# EAGLE design SolderingStation (EAGLE 7.1.0)
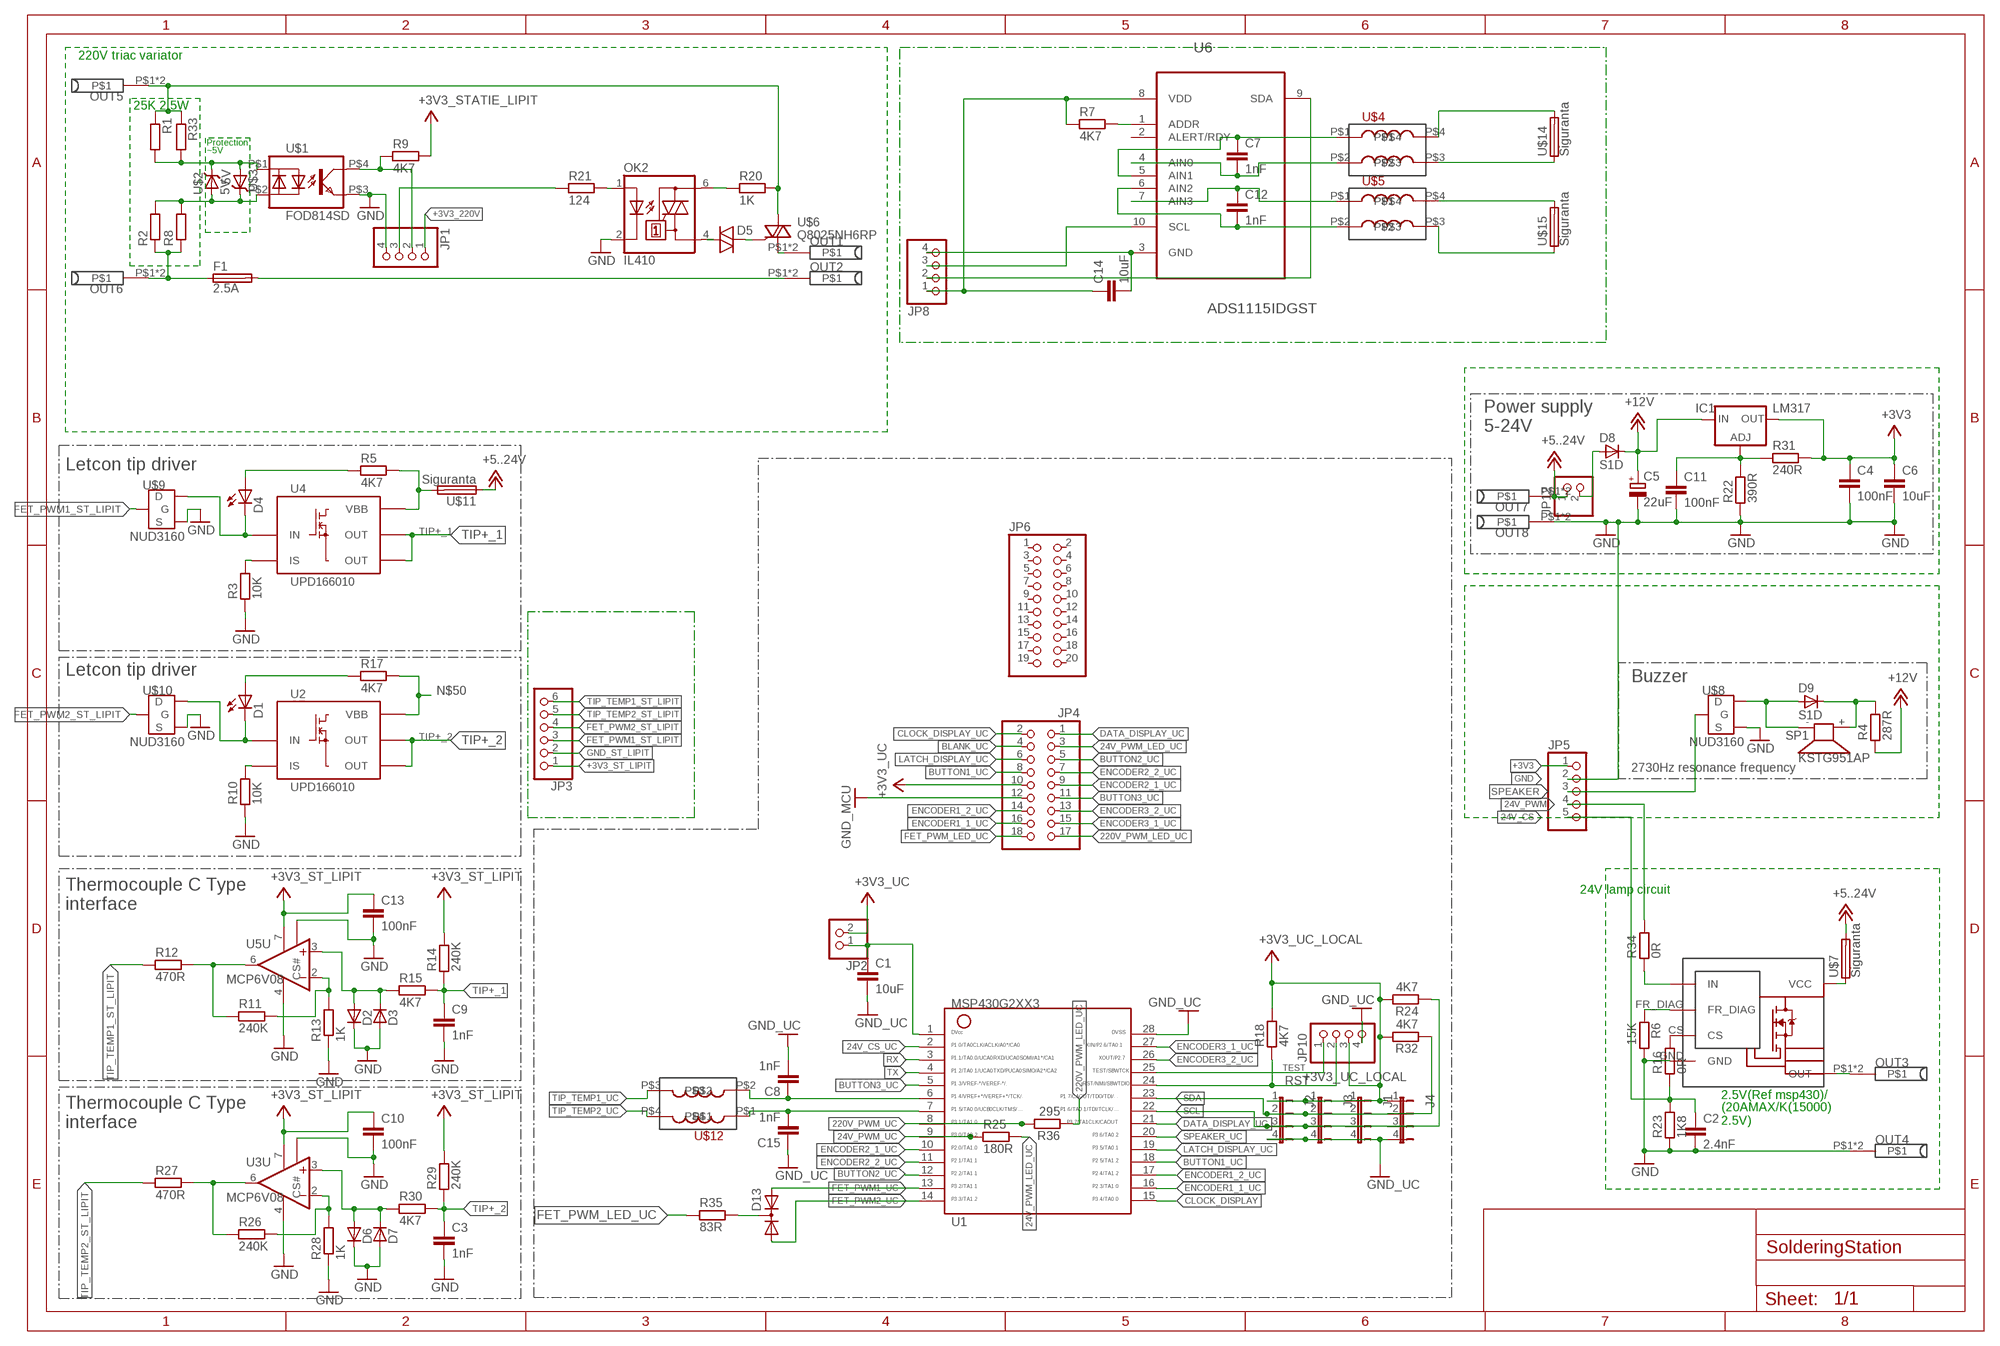
[diagram p0: schematic, sheet 1]

## Parts
C1  10uF  C1206  [1206]
C2  2.4nF  C0805  [0805]
C3  1nF  C0805  [0805]
C4  100nF  C1206  [1206]
C5  22uF  C_ELECTROLYTIC2  [C_EL_6.3X5.4]
C6  10uF  C1206  [1206]
C7  1nF  C0805  [0805]
C8  1nF  C0805  [0805]
C9  1nF  C0805  [0805]
C10  100nF  C0805  [0805]
C11  100nF  C1206  [1206]
C12  1nF  C0805  [0805]
C13  100nF  C0805  [0805]
C14  10uF  C0805  [0805]
C15  1nF  C0805  [0805]
CLH1  VN7004  [OCTAPAK]
D1  LED3MM  [LED_3MM]
D2  DIODES1D  [S1D]
D3  DIODES1D  [S1D]
D4  LED3MM  [LED_3MM]
D5  DIAC-DO35-10  [DO35-10]
D6  DIODES1D  [S1D]
D7  DIODES1D  [S1D]
D8  S1D  DIODES1D  [S1D]
D9  S1D  DIODES1D  [S1D]
D13  DIODE-2AC|CASOT23  [SOT23]
F1  2.5A  GSH15  [GSH15]
IC1  LM317  LM317MABDT  [DPACK]
J1  JP4  [JP4]
J2  JP4  [JP4]
J3  JP4  [JP4]
J4  JP4  [JP4]
JP1  PINHD-1X4/90  [1X04/90]
JP2  PINHD-1X2  [1X02]
JP3  PINHD-1X6/90  [1X06/90]
JP4  PINHD-2X9  [2X09]
JP5  PINHD-1X5/90  [1X05/90]
JP6  PINHD-2X10/90  [2X10/90]
JP8  PINHD-1X4/90  [1X04/90]
JP10  PINHD-1X4  [1X04]
JP12  PINHD-1X2  [1X02]
OK2  IL410  [DIL06]
OUT1  BANANA  [BANANA]
OUT2  BANANA  [BANANA]
OUT3  BANANA  [BANANA]
OUT4  BANANA  [BANANA]
OUT5  BANANA  [BANANA]
OUT6  BANANA  [BANANA]
OUT7  BANANA  [BANANA]
OUT8  BANANA  [BANANA]
R1  RESISTOR-PTH-0.4  [RTH025W]
R2  RESISTOR-PTH-0.4  [RTH025W]
R3  10K  R0805  [0805]
R4  287R  R1206  [1206]
R5  4K7  R0805  [0805]
R6  15K  R0805  [0805]
R7  4K7  R0805  [0805]
R8  RESISTOR-PTH-0.4  [RTH025W]
R9  4K7  R1206  [1206]
R10  10K  R0805  [0805]
R11  240K  R0805  [0805]
R12  470R  R0805  [0805]
R13  1K  R0805  [0805]
R14  240K  R0805  [0805]
R15  4K7  R0805  [0805]
R16  0R  R0805  [0805]
R17  4K7  R0805  [0805]
R18  4K7  R0805  [0805]
R20  1K  R1206  [1206]
R21  124  R1206  [1206]
R22  390R  R0805  [0805]
R23  1K8  R0805  [0805]
R24  4K7  R0805  [0805]
R25  180R  R0805  [0805]
R26  240K  R0805  [0805]
R27  470R  R0805  [0805]
R28  1K  R0805  [0805]
R29  240K  R0805  [0805]
R30  4K7  R0805  [0805]
R31  240R  R0805  [0805]
R32  4K7  R0805  [0805]
R33  RESISTOR-PTH-0.4  [RTH025W]
R34  0R  R0805  [0805]
R35  83R  R0805  [0805]
R36  295  R1206  [1206]
SP1  KSTG951AP  [KSTG951AP]
U1  MSP340G2443  G2XX3---PW28  [PW28]
U2  UPD166010  [TO252-51]
U3  MCP6V08  MCP6V08SN  [SO08]
U4  UPD166010  [TO252-51]
U5  MCP6V08  MCP6V08SN  [SO08]
U6  ADS1115IDGST  [SOP50P490X110-10N]
U$1  FOD814SD  [DIP_4PIN]
U$2  5V  ZENER  [ZENER]
U$3  5V  ZENER  [ZENER]
U$4  COIL  [UNDEF1]
U$5  COIL  [UNDEF1]
U$6  Q8025NH6RP  [TO-263]
U$7  Siguranta  SOCLU_THERMOCOUPLE  [SOCLU_THERMOCOUPLE]
U$8  NUD3160  [SOT23]
U$9  NUD3160  [SOT23]
U$10  NUD3160  [SOT23]
U$11  Siguranta  SOCLU_THERMOCOUPLE  [SOCLU_THERMOCOUPLE]
U$12  COIL  [UNDEF1]
U$14  Siguranta  SOCLU_THERMOCOUPLE  [SOCLU_THERMOCOUPLE]
U$15  Siguranta  SOCLU_THERMOCOUPLE  [SOCLU_THERMOCOUPLE]

## Nets
24V_CS: C2.1 JP5.5 R16.1 R23.2
24V_CS_UC: U1.2
24V_PWM: JP5.4 R34.2
24V_PWM_LED_UC: JP4.3 R25.2
24V_PWM_UC: R25.1 U1.9
220V_PWM_LED_UC: JP4.17 R36.1
220V_PWM_UC: R36.2 U1.8
+3V3: C4.1 C6.1 IC1.4(OUT) JP5.1 R31.2
+3V3_220V: JP1.1 R9.2 ; supply symbol labelled +3V3_STATIE_LIPIT
+3V3_ST_LIPIT: C10.1 C13.1 JP3.1 R14.2 R29.2 U3.7(U:V+) U5.7(U:V+)
+3V3_UC: JP2.2 JP4.10
+3V3_UC_LOCAL: C1.1 J1.1 J2.1 J3.1 J4.1 JP2.1 JP10.3 R18.2 R24.2 R32.2 U1.1
+12V: C5.+ D8.C IC1.3(IN) R4.1
+15V: JP12.1 OUT7.P$1 OUT7.P$2 U$7.1B U$7.2B U$11.1A U$11.2A ; supply symbol labelled +5..24V
BLANK_UC: JP4.4
BUTTON1_UC: JP4.8 U1.18
BUTTON2_UC: JP4.5 U1.12
BUTTON3_UC: JP4.11 U1.5
CLOCK_DISPLAY: U1.15
CLOCK_DISPLAY_UC: JP4.2
DATA_DISPLAY_UC: JP4.1 U1.21
ENCODER1_1_UC: JP4.16 U1.16
ENCODER1_2_UC: JP4.14 U1.17
ENCODER2_1_UC: JP4.9 U1.10
ENCODER2_2_UC: JP4.7 U1.11
ENCODER3_1_UC: JP4.15 U1.27
ENCODER3_2_UC: JP4.13 U1.26
FET_PWM1_ST_LIPIT: JP3.3 U$9.1(G)
FET_PWM1_UC: D13.2(A2) U1.13
FET_PWM2_ST_LIPIT: JP3.4 U$10.1(G)
FET_PWM2_UC: D13.1(A1) U1.14
FET_PWM_LED_UC: JP4.18 R35.1
GND: C2.2 C4.2 C5.- C6.2 C8.2 C11.2 C15.1 CLH1.GND J2.4 J3.4 J4.4 JP5.2 OUT4.P$1 OUT4.P$2 OUT8.P$1 OUT8.P$2 R6.2 R22.1 R23.1 U$8.2(S) ; supply symbol labelled GND_UC
GND_220V: JP1.4 OK2.2(C) U$1.P$3(EMIT) ; supply symbol labelled GND
GND_ST_LIPIT: C3.2 C9.2 C10.2 C13.2 D2.C D3.A D6.C D7.A JP3.2 R3.1 R10.1 R13.1 R28.1 U3.4(U:V-) U3.8(CS#) U5.4(U:V-) U5.8(CS#) U$9.2(S) U$10.2(S) ; supply symbol labelled GND
GND_TERMOCOUPLE: C14.2 JP8.4 U6.3(GND)
GND_UC: C1.2 JP4.12 JP10.4 U1.28 ; supply symbol labelled GND_MCU
LATCH_DISPLAY_UC: JP4.6 U1.19
N$2: D1.K(C) U2.2(IN) U$10.3(D)
N$3: D4.A R5.1
N$4: D1.A R17.1
N$5: D9.A SP1.- U$8.3(D)
N$6: CLH1.CS R16.2
N$7: D4.K(C) U4.2(IN) U$9.3(D)
N$8: R10.2 U2.4(IS)
N$9: R26.1 R27.2 U3.6(U:OUT)
N$10: D6.A D7.C R30.1 U3.3(U:+IN)
N$11: R26.2 R28.2 U3.2(U:-IN)
N$12: OK2.6(A2) R20.1
N$13: D5.A OK2.4(A1)
N$14: OK2.1(A) R21.2
N$15: JP1.3 R21.1
N$16: CLH1.VCC U$7.1A U$7.2A
N$18: D5.C U$6.G
N$19: D9.C R4.2 SP1.+
N$20: CLH1.FR_DIAG R6.1
N$21: F1.1 OUT6.P$1 OUT6.P$2 R2.1 R8.1
N$27: R3.2 U4.4(IS)
N$28: D13.3(C) R35.2
N$29: R11.1 R12.2 U5.6(U:OUT)
N$30: R1.2 R33.2 U$1.P$1(ANODE) U$2.K U$3.A
N$31: D2.A D3.C R15.1 U5.3(U:+IN)
N$32: R2.2 R8.2 U$1.P$2(CATHODE) U$2.A U$3.K
N$34: R11.2 R13.2 U5.2(U:-IN)
N$35: CLH1.OUTPUT1(OUT) CLH1.OUTPUT2(OUT) CLH1.OUTPUT3(OUT) OUT3.P$1 OUT3.P$2
N$36: JP1.2 R9.1 U$1.P$4(COL)
N$37: C8.1 U1.6 U$12.P$2
N$38: R7.2 U6.1(ADDR)
N$39: C15.2 U1.7 U$12.P$1
N$40: C7.1 U6.5(AIN1) U$4.P$1
N$41: C7.2 U6.4(AIN0) U$4.P$2
N$42: C11.1 IC1.1(ADJ) R22.2 R31.1
N$43: C12.1 U6.7(AIN3) U$5.P$1
N$44: C12.2 U6.6(AIN2) U$5.P$2
N$46: CLH1.INPUT(IN) R34.1
N$50: R5.2 R17.2 U2.TAB(VBB) U4.TAB(VBB) U$11.1B U$11.2B
N$51: D8.A JP12.2
N$52: U$4.P$3 U$14.1A U$14.2A
N$53: U$4.P$4 U$14.1B U$14.2B
N$54: U$5.P$4 U$15.1B U$15.2B
N$55: U$5.P$3 U$15.1A U$15.2A
N$56: J1.4
RST: JP10.2 R18.1 U1.24
RX: U1.3
SCL: J1.3 J2.3 J3.3 J4.3 R24.1 U1.22
SCL_TERMOCOUPLE: JP8.3 U6.10(SCL)
SDA: J1.2 J2.2 J3.2 J4.2 R32.1 U1.23
SDA_TERMOCOUPLE: JP8.2 U6.9(SDA)
SPEAKER: JP5.3 U$8.1(G)
SPEAKER_UC: U1.20
TEST: JP10.1 U1.25
TIP+_1: C9.1 R14.1 R15.2 U4.1(OUT) U4.5(OUT)
TIP+_2: C3.1 R29.1 R30.2 U2.1(OUT) U2.5(OUT)
TIP_TEMP1_ST_LIPIT: JP3.6 R12.1
TIP_TEMP1_UC: U$12.P$3
TIP_TEMP2_ST_LIPIT: JP3.5 R27.1
TIP_TEMP2_UC: U$12.P$4
TX: U1.4
VCC_TERMOCOUPLE: C14.1 JP8.1 R7.1 U6.8(VDD)
~+OUT: F1.2 OUT2.P$1 OUT2.P$2
~-OUT: OUT1.P$1 OUT1.P$2 U$6.T1
~IN1: OUT5.P$1 OUT5.P$2 R1.1 R20.2 R33.1 U$6.T2
Unconnected: JP6.1 JP6.2 JP6.3 JP6.4 JP6.5 JP6.6 JP6.7 JP6.8 JP6.9 JP6.10 JP6.11 JP6.12 JP6.13 JP6.14 JP6.15 JP6.16 JP6.17 JP6.18 JP6.19 JP6.20 U6.2(ALERT/RDY)

## Notes on the sheet
- 220V triac variator
- 25K 2.5W
- Protection
- ~5V
- Power supply
- 5-24V
- Letcon tip driver
- Letcon tip driver
- Buzzer
- 2730Hz resonance frequency
- Thermocouple C Type | 24V lamp circuit
- interface
- 2.5V(Ref msp430)/
- Thermocouple C Type
- (20AMAX/K(15000)
  2.5V)
- interface

## Library data of the parts
C1 C3 C7-C10 C12 C13 C15 = adi_v1.2:C: SMD capacitor 0603 0805 1206
C2 C4 C6 C11 C14 = ATE:C: SMD capacitor 0603 0805 1206
C5 = adi_v1.4:C_ELECTROLYTIC: Electrolytic capacitor 8x10mm 6.3x5.4mm
CLH1 = Serghei IR station:VN7004
D1 D4 = adi_v1.4:LED: LED
D2 D3 D6-D8 = adi_v1.3:DIODE: Generic Diode
D5 = diode:DIAC-: DIAC
D9 = adi_v1.4:DIODE: Generic Diode
D13 = diode:DIODE-2AC|CA: Dual DIODE Anode-Cathode|Cathode-Anode
F1 = fuse:GSH15: FUSE HOLDER grid 15mm, 19649 Wickmann; MPN: 64900001039; OC_FARNELL: 1271673; OC_NEWARK: 02P0318
IC1 = v-reg:LM317?*: 500 mA Adjustable Output Positive Voltage Regulator Source: http://www.onsemi.co.jp .. LM317M-D.PDF
J1-J4 = adi_v1.4:JP4
JP1 JP8 JP10 = pinhead:PINHD-1X4: PIN HEADER
JP2 JP12 = pinhead:PINHD-1X2: PIN HEADER
JP3 = pinhead:PINHD-1X6: PIN HEADER
JP4 = pinhead:PINHD-2X9: PIN HEADER
JP5 = pinhead:PINHD-1X5: PIN HEADER
JP6 = pinhead:PINHD-2X10: PIN HEADER
OK2 = optocoupler:IL410: SIEMENS OPTO COUPLER; MF: VISHAY/TELEFUNKEN; MPN: IL410; OC_FARNELL: 1045434; OC_NEWARK: 58K1715
OUT1-OUT8 = H_bridge_library:BANANA
R1 R2 R8 R33 = dp_devices:RESISTOR
R3-R7 R10-R18 R22-R32 R34 R35 = adi_v1.2:R
R9 R20 R21 R36 = H_bridge_library:R
SP1 = adi_v1.4:KSTG951AP: SPEAKER Source: Schukat; OC_FARNELL: http://ro.farnell.com/kingstate/kstg951ap/buzzer-magnetic-pin-85db-5v/dp/2215078?Ntt=KSTG951AP; OC_NEWARK: unknown
U1 = adi_v1.3:G2XX3---PW28: MSP430G2XX1 TSSOP (PW) 28 Pin Package
U2 U4 = adi_v1.3:UPD166010
U3 U5 = adi_v1.3:MCP6V08: Single Op Amp 2.7V to 6.0V Single Supply CMOS Source: http://ww1.microchip.com/downloads/en/DeviceDoc/21314g.pdf
U6 = Texas Instruments_By_element14_Batch_1:ADS1115IDGST: Analog-to-Digital Converter with Internal Reference; MPN: ADS1115IDGST; OC_FARNELL: 1762981; OC_NEWARK: 25R1241; PACKAGE: MSOP-10; SUPPLIER: Texas Instruments
U$1 = Serghei IR station:FOD814SD
U$2 U$3 = adi_v1.6:ZENER: Zener diode - Farnell <http://ro.farnell.com/vishay-semiconductor/1n5231b/diode-zener-5-1v-0-5w/dp/1612371> 1N5231B DIODE, ZENER, 5.1V, 0.5W Diode Case Style:DO-35 Forward Current If(AV):200mA Termination Type:Axial Leaded
U$4 U$5 U$12 = Serghei IR station:COIL
U$6 = Serghei IR station:Q8025NH6RP
U$7 U$11 U$14 U$15 = Serghei IR station:SOCLU_THERMOCOUPLE
U$8-U$10 = adi_v1.4:NUD3160

## Board
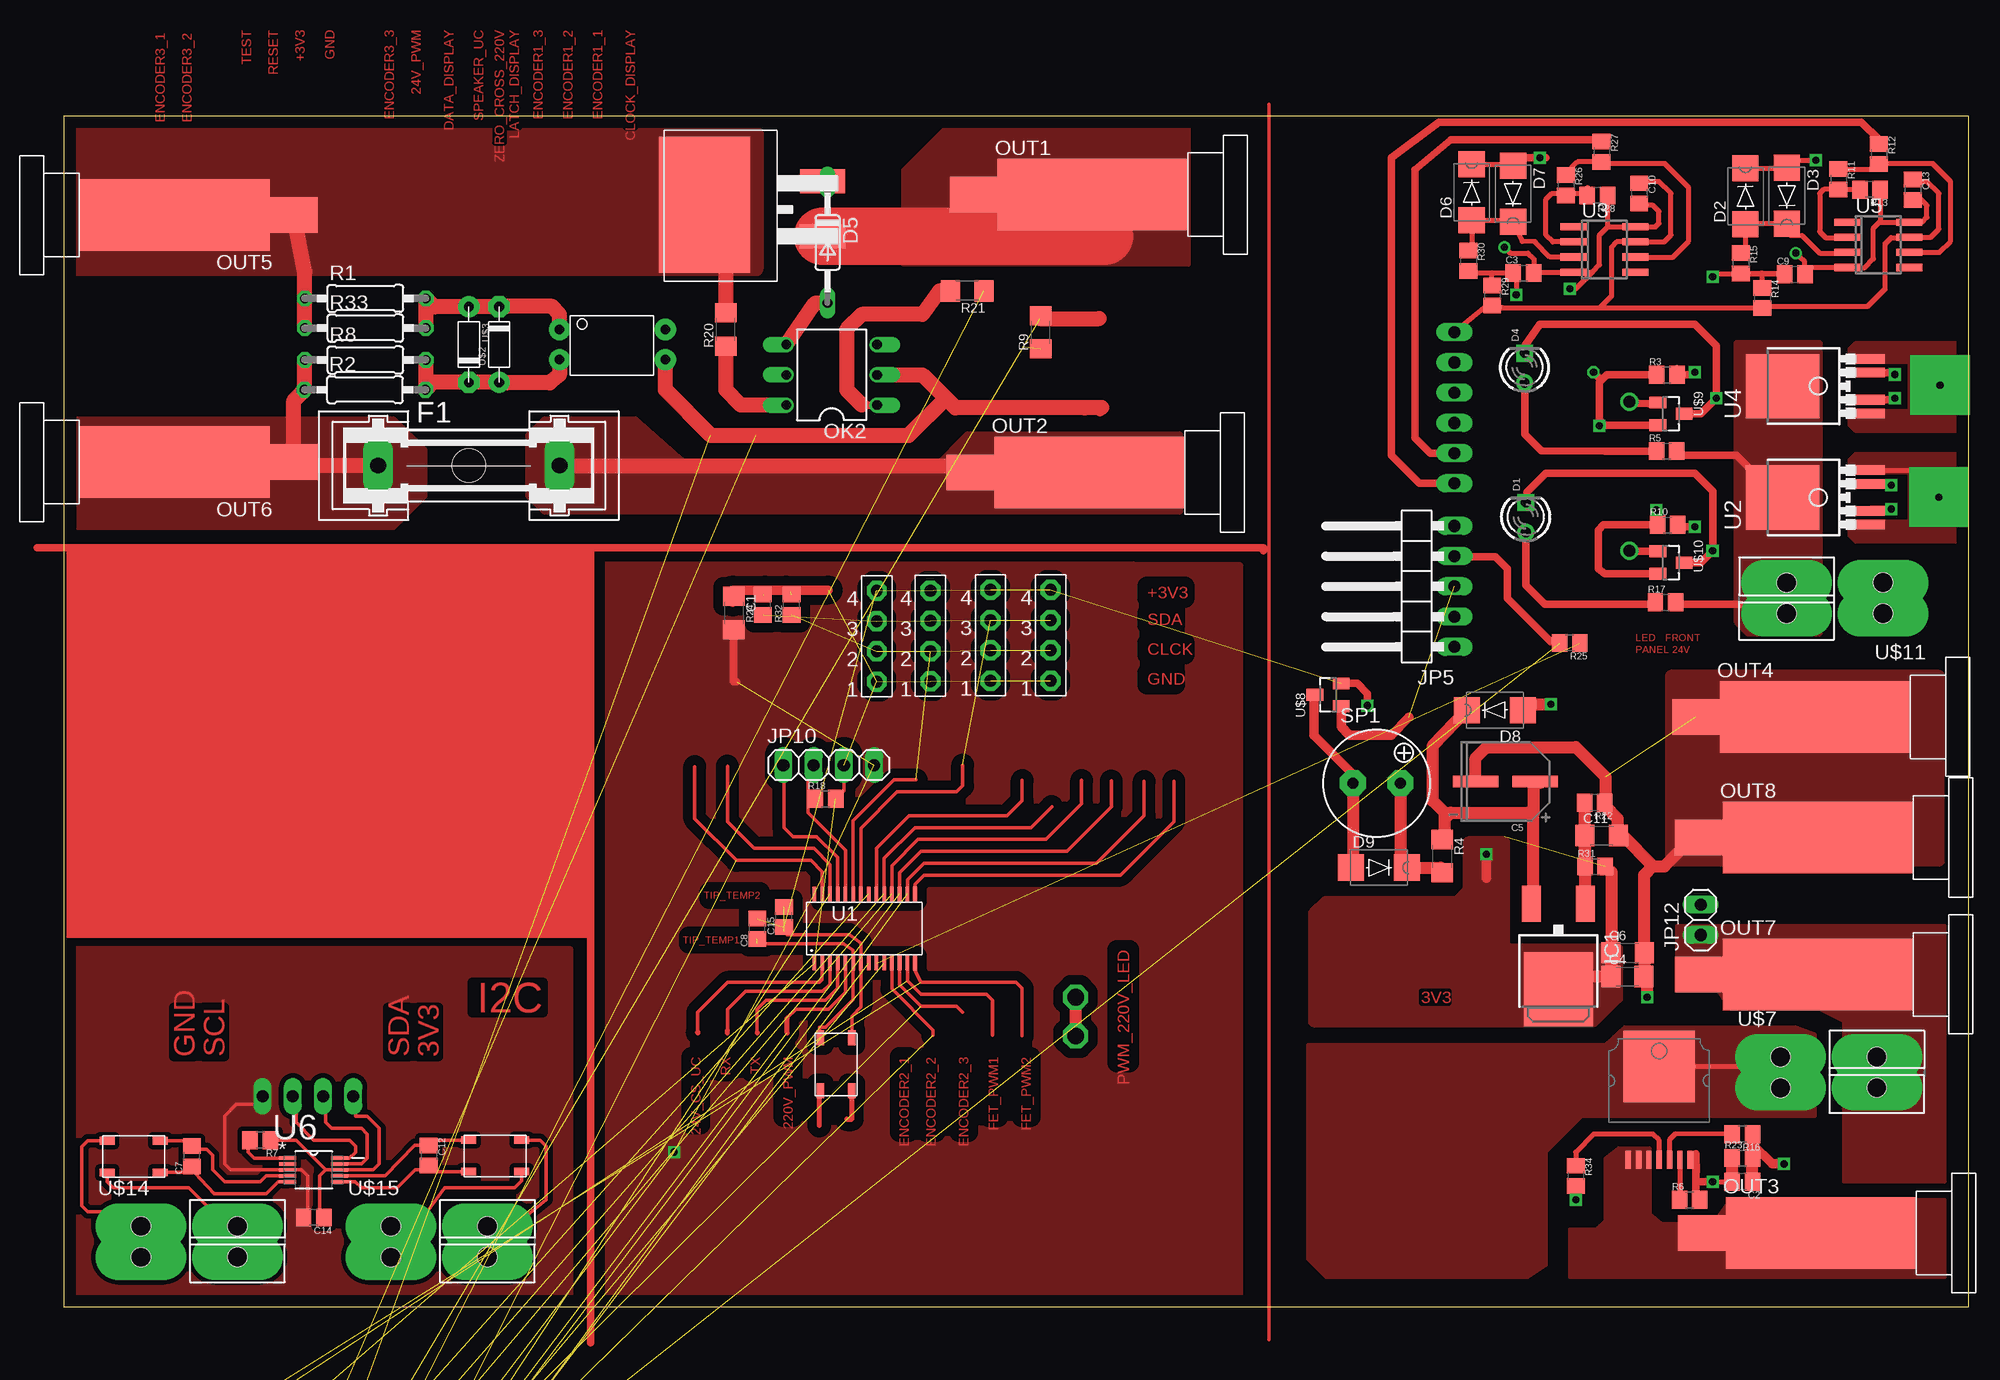
[diagram p1: board, top side]
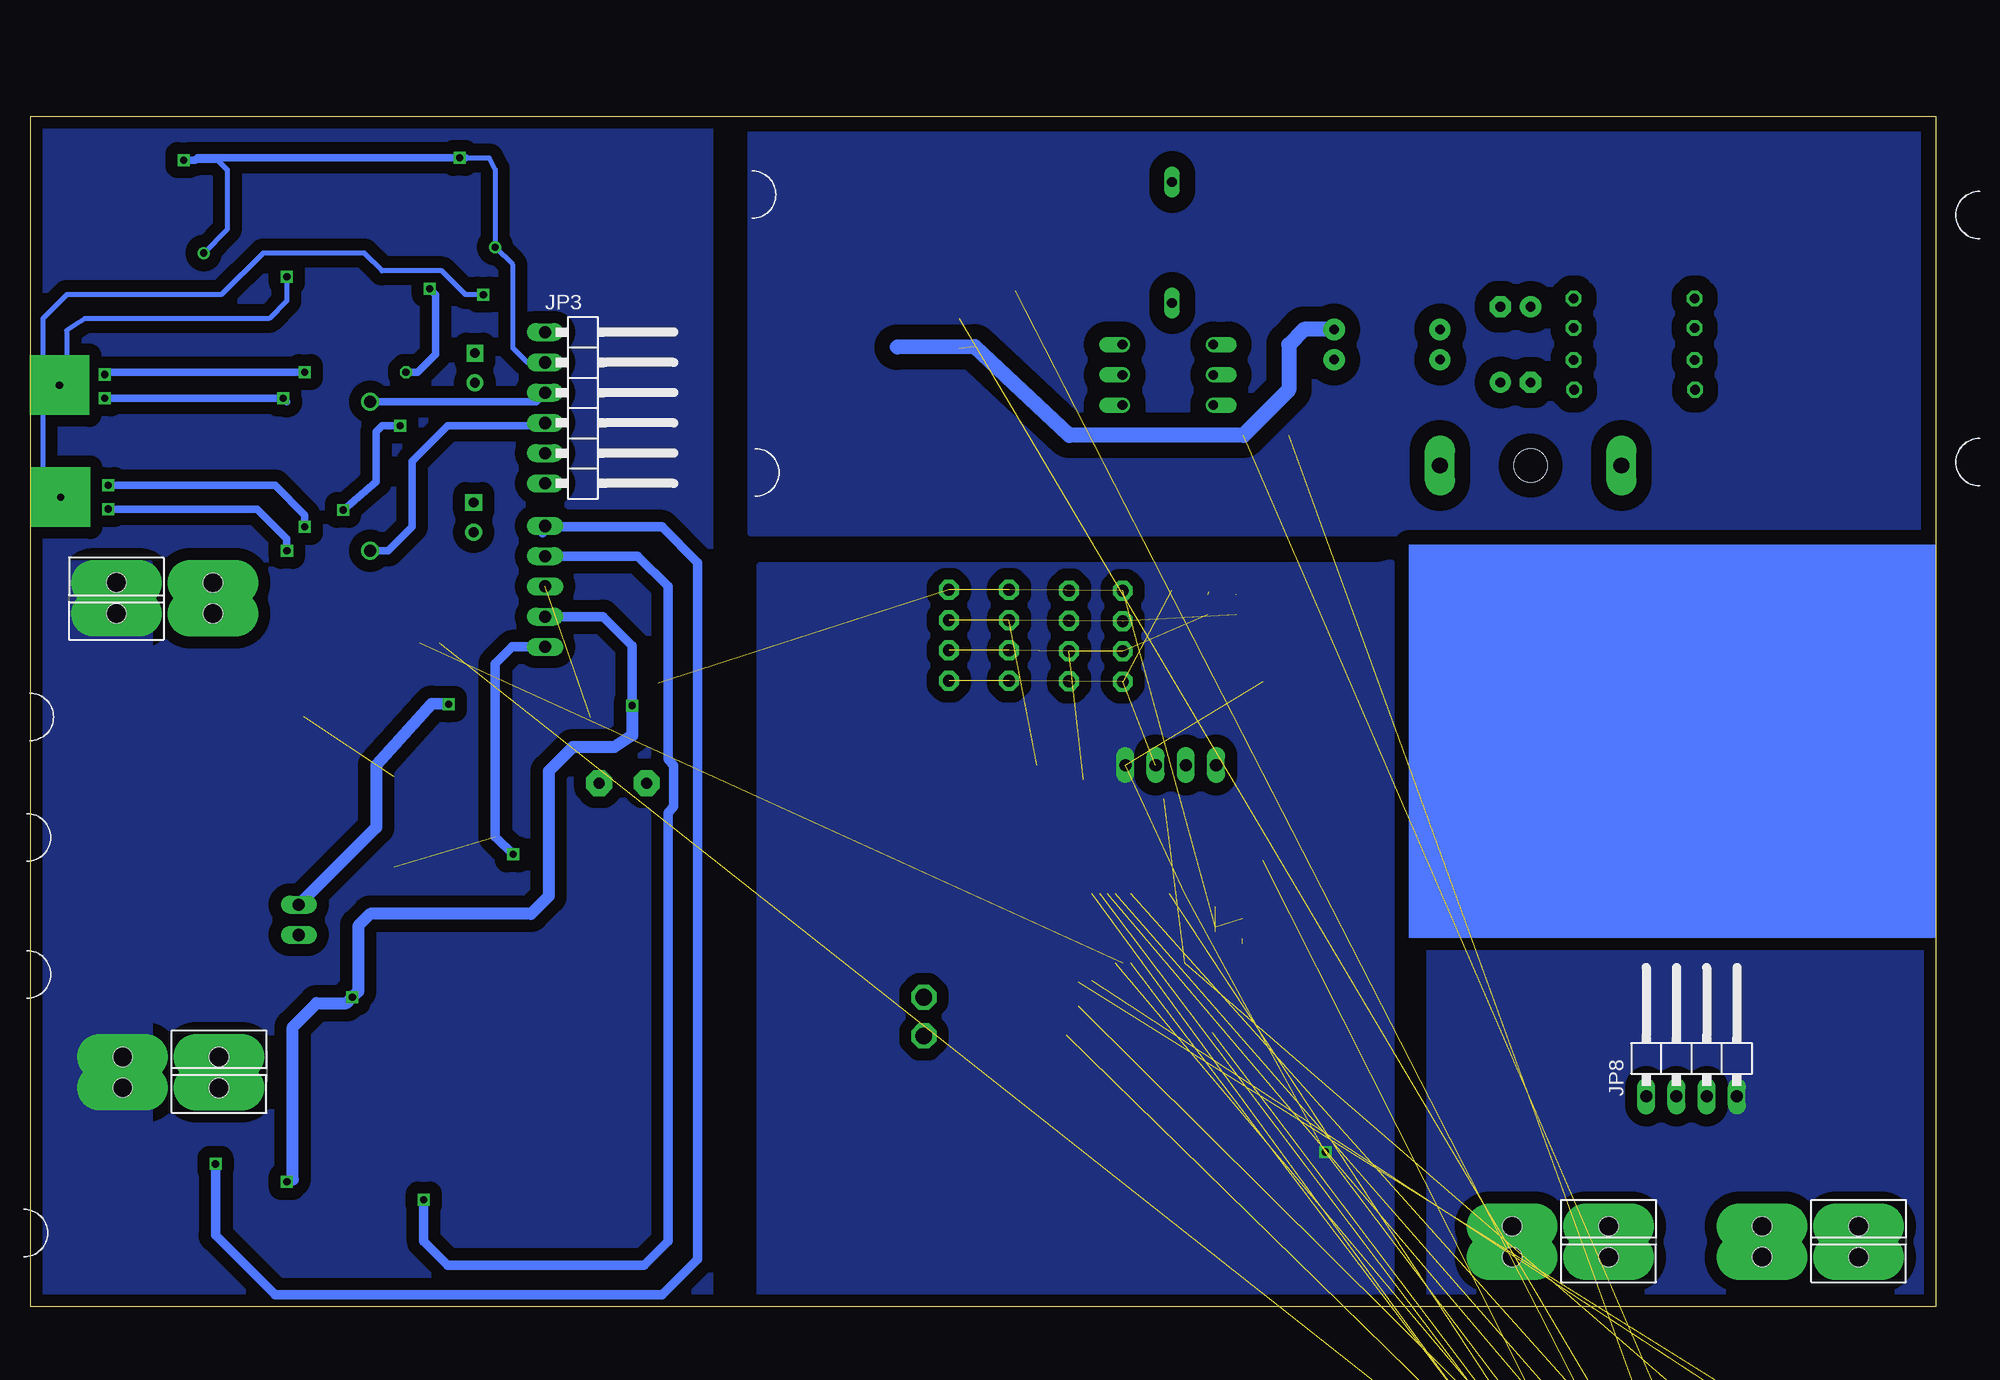
[diagram p2: board, bottom side, seen from below]

Size 160 x 100 mm. Coordinates in mm from the lower left corner, seen from the top.
Outline: 0,0 160,0 160,100 0,100 0,0
Copper layers (1*16): Top 0.035mm / dielectric 1.5mm / Bottom 0.035mm
Design rules "default": minimum track width 10mil, minimum drill 24mil, track to track 8mil, track to pad 8mil, pad to pad 8mil, via to via 8mil, smd to smd 8mil, copper to edge 40mil, drill to drill 8mil, minimum pad ring 10mil, minimum via ring 8mil, stop-mask expansion 4mil, vias tented up to drill 0mil, thermal gap 10mil

### Footprints (pad centres in the part's own frame; a part is rotated, then mirrored left to right if it is on the bottom)
1206 = smd 1.6 x 1.8: 1 -1.4,0; 2 1.4,0
0805 = smd 1.3 x 1.5: 1 -0.85,0; 2 0.85,0
C_EL_6.3X5.4 = smd 3.81 x 1: + -2.5,0; - 2.5,0
OCTAPAK = smd 0.45 x 1.5: CS 0.88,-7.14; FR_DIAG 1.75,-7.14; GND 2.62,-7.14; INPUT 0.01,-7.14; OUTPUT1 -1.73,-7.14; OUTPUT2 -2.6,-7.14; OUTPUT3 -0.86,-7.14 | smd 6 x 6: VCC 0,0.69
LED_3MM = drill 0.813 pad 1.422: A -1.3,0 | drill 0.813 pad 1.422 square: K 1.2,0
S1D = smd 2.2 x 2.2: A -2.35,0; C 2.35,0
DO35-10 = drill 0.813 long: A 5.08,0; C -5.08,0
SOT23 = smd 1 x 1.4: 1 -0.95,-1.1; 2 0.95,-1.1; 3 0,1.1
GSH15 = drill 1.321 pad 2.54 long: 1 -7.62,0; 2 7.62,0 | hole 2.794: 0,0
DPACK = smd 1.6 x 3: 1 -2.28,-4.8; 3 2.28,-4.8 | smd 5.8 x 6.2: 4 0,2.38
JP4 = drill 1 pad 1.676 octagon: 1 0,-3.81; 2 0,-1.27; 3 0,1.27; 4 0,3.81
1X04/90 = drill 1.016 long: 1 -3.81,-3.81; 2 -1.27,-3.81; 3 1.27,-3.81; 4 3.81,-3.81
1X02 = drill 1.016 long: 1 -1.27,0; 2 1.27,0
1X06/90 = drill 1.016 long: 1 -6.35,-3.81; 2 -3.81,-3.81; 3 -1.27,-3.81; 4 1.27,-3.81; 5 3.81,-3.81; 6 6.35,-3.81
2X09 = drill 1.016 octagon: 1 -10.16,-1.27; 2 -10.16,1.27; 3 -7.62,-1.27; 4 -7.62,1.27; 5 -5.08,-1.27; 6 -5.08,1.27; 7 -2.54,-1.27; 8 -2.54,1.27; 9 0,-1.27; 10 0,1.27; 11 2.54,-1.27; 12 2.54,1.27; 13 5.08,-1.27; 14 5.08,1.27; 15 7.62,-1.27; 16 7.62,1.27; 17 10.16,-1.27; 18 10.16,1.27
1X05/90 = drill 1.016 long: 1 -5.08,-3.81; 2 -2.54,-3.81; 3 0,-3.81; 4 2.54,-3.81; 5 5.08,-3.81
2X10/90 = drill 1.016 octagon: 1 -11.43,-6.35; 2 -11.43,-3.81; 3 -8.89,-6.35; 4 -8.89,-3.81; 5 -6.35,-6.35; 6 -6.35,-3.81; 7 -3.81,-6.35; 8 -3.81,-3.81; 9 -1.27,-6.35; 10 -1.27,-3.81; 11 1.27,-6.35; 12 1.27,-3.81; 13 3.81,-6.35; 14 3.81,-3.81; 15 6.35,-6.35; 16 6.35,-3.81; 17 8.89,-6.35; 18 8.89,-3.81; 19 11.43,-6.35; 20 11.43,-3.81
1X04 = drill 1.016 long: 1 -3.81,0; 2 -1.27,0; 3 1.27,0; 4 3.81,0
DIL06 = drill 0.813 offset: 1 -2.54,-3.81; 2 0,-3.81; 3 2.54,-3.81; 4 2.54,3.81; 5 0,3.81; 6 -2.54,3.81
BANANA = smd 16 x 6: P$1 0.84,-0.08 | smd 4 x 3: P$2 -9.16,-0.08
RTH025W = drill 0.813 octagon: 1 -5.08,0; 2 5.08,0
KSTG951AP = drill 0.914 pad 2.159 octagon: + 2,0; - -2,0
PW28 = smd 0.3 x 1.2: 1 -4.229,-2.908; 2 -3.579,-2.908; 3 -2.929,-2.908; 4 -2.279,-2.908; 5 -1.629,-2.908; 6 -0.979,-2.908; 7 -0.329,-2.908; 8 0.321,-2.908; 9 0.971,-2.908; 10 1.621,-2.908; 11 2.271,-2.908; 12 2.921,-2.908; 13 3.571,-2.908; 14 4.221,-2.908; 15 4.221,2.892; 16 3.571,2.892; 17 2.921,2.892; 18 2.271,2.892; 19 1.621,2.892; 20 0.971,2.892; 21 0.321,2.892; 22 -0.329,2.892; 23 -0.979,2.892; 24 -1.629,2.892; 25 -2.279,2.892; 26 -2.929,2.892; 27 -3.579,2.892; 28 -4.229,2.892
TO252-51 = smd 0.8 x 2.6: 1 -2.28,-4.8; 2 -1.14,-4.8; 4 1.14,-4.8; 5 2.28,-4.8 | smd 5.4 x 6.2: TAB 0,2.5
SO08 = smd 0.6 x 2.2: 1 -1.905,-2.6; 2 -0.635,-2.6; 3 0.635,-2.6; 4 1.905,-2.6; 5 1.905,2.6; 6 0.635,2.6; 7 -0.635,2.6; 8 -1.905,2.6
SOP50P490X110-10N = smd 1.422 x 0.279: 1 -2.184,0.991; 2 -2.184,0.508; 3 -2.184,0; 4 -2.184,-0.508; 5 -2.184,-0.991; 6 2.184,-0.991; 7 2.184,-0.508; 8 2.184,0; 9 2.184,0.508; 10 2.184,0.991
DIP_4PIN = drill 0.8 pad 1.778: P$1 1.27,5.08; P$2 -1.27,5.08; P$3 -1.27,-3.81; P$4 1.27,-3.81
ZENER = drill 0.813 pad 1.778: A -3.175,0 | drill 0.813 pad 1.778 octagon: K 3.175,0
UNDEF1 = smd 1.27 x 0.635: P$1 -2.1,1.2; P$2 -2.1,-1.45; P$3 2.35,-1.45; P$4 2.35,1.2
TO-263 = smd 2 x 3.81: G 4.6,0; T1 0,0 | smd 11.43 x 7.62: T2 2.635,9.905
SOCLU_THERMOCOUPLE = drill 1.6 pad 3.81 long: 1A -4.019,1.281; 1B 4.081,1.281; 2A -4.019,-1.319; 2B 4.081,-1.321 | hole 1.6: -4.02,1.28; -4.02,-1.33; 4.08,-1.31; 4.08,1.28

### Placement (x,y rotation side)
C1  56.28,58.27 270 top
C2  141,10.5 180 top
C3  122.61,86.82 0 top
C4  131.34,27.74 0 top
C5  121.08,44.12 180 top
C6  131.36,29.74 0 top
C7  10.76,12.65 90 top
C8  58.25,31.75 90 top
C9  145.4,86.72 0 top
C10  132.32,93.51 270 top
C11  129.18,39.59 0 top
C12  30.66,12.71 270 top
C13  155.32,93.82 270 top
C14  21,7.5 180 top
C15  60.5,32.75 90 top
CLH1  134,19.5 0 top
D1  122.81,66.35 90 top
D2  141.26,93.26 90 top
D3  144.74,93.32 270 top
D4  122.71,78.9 90 top
D5  64.15,89.38 270 top
D6  118.26,93.6 90 top
D7  121.74,93.48 270 top
D8  120.21,50.11 180 top
D9  110.47,36.89 0 top
D13  -1.25,-18 0 top  (outside the outline)
F1  34.02,70.65 0 top
IC1  125.55,29.05 180 top
J1  72.79,56.34 0 top
J2  68.29,56.32 0 top
J3  77.84,56.4 0 top
J4  82.9,56.4 0 top
JP1  3.75,-51.75 0 top  (outside the outline)
JP2  -0.5,-27.25 0 top  (outside the outline)
JP3  113,75.5 270 bottom
JP4  8.25,-41.75 0 top  (outside the outline)
JP5  113,60.5 90 top
JP6  11.5,-69.5 0 top  (outside the outline)
JP8  20.5,21.5 0 bottom
JP10  64.25,45.5 0 top
JP12  137.5,32.5 90 top
OK2  64.5,78.27 90 top
OUT1  85.59,93.49 0 top
OUT2  85.32,70.15 0 top
OUT3  146.76,6.28 0 top
OUT4  146.26,49.62 0 top
OUT5  10.15,91.61 180 top
OUT6  10.15,70.86 180 top
OUT7  146.5,28 0 top
OUT8  146.5,39.5 0 top
R1  25.33,84.69 0 top
R2  25.3,77.03 0 top
R3  134.66,78.27 0 top
R4  115.77,37.85 270 top
R5  134.64,71.87 0 top
R6  136.57,9 0 top
R7  16.5,14 180 top
R8  25.33,79.52 0 top
R9  82.07,81.85 90 top
R10  134.71,65.67 0 top
R11  149.07,94.7 270 top
R12  152.47,96.81 270 top
R13  151.72,93.83 180 top
R14  142.67,84.73 270 top
R15  140.87,87.64 270 top
R16  141,14.5 180 top
R17  134.54,59.17 0 top
R18  63.98,42.67 0 top
R20  55.61,82.08 90 top
R21  75.88,85.33 180 top
R22  128.58,42.33 180 top
R23  141,12.5 0 top
R24  58.72,58.96 90 top
R25  126.5,55.75 180 top
R26  126.17,94.2 270 top
R27  129.17,97.01 270 top
R28  128.82,93.33 180 top
R29  119.98,84.94 270 top
R30  117.98,87.85 270 top
R31  128.64,36.98 0 top
R32  61.13,58.96 90 top
R33  25.33,82.2 0 top
R34  127,11 270 top
R35  -1.5,-21.75 0 top  (outside the outline)
R36  -1,-59.75 0 top  (outside the outline)
SP1  110.28,43.98 0 top
U1  67.28,31.78 0 top
U2  146.88,67.98 90 top
U3  129.41,88.8 270 top
U4  146.88,77.32 90 top
U5  152.41,89.19 270 top
U6  21,11.5 0 top
U$1  46.72,80.81 90 top
U$2  36.56,80.81 90 top
U$3  34.02,80.81 270 top
U$4  6,12.5 180 top
U$5  36.1,12.8 0 top
U$6  63.74,89.92 90 top
U$7  148.22,19.71 0 top
U$8  106.2,51.4 90 top
U$9  135,75 270 top
U$10  135,62.5 270 top
U$11  148.8,59.5 180 top
U$12  65,20.5 270 top
U$14  10.5,5.5 0 top
U$15  31.5,5.5 0 top

### Tracks (layer width: path | path; a pad name or v marks a point on that pad's centre or on a via)
24V_CS  (via drill 0.6)
  Top 0.813: R16.1 141.85,13.65 143.5,12 v144.5,12
  Top 1.016: C2.1 R23.2 R16.1
  Bottom 0.813: v144.5,12 144.5,6 139.5,1 107,1 104,4 104,62.5 107,65.5 117,65.5 117,65.39 | 117,65 117,65.39 | 117,65.39 JP5.5
24V_CS_UC
  Top 0.305: U1.2 63.7,27.45 63.5,27.25 55.75,27.25 53.25,24.75 53.25,23.1
  Top 0.406: 53.25,23 53.25,23.1
24V_PWM  (via drill 0.6)
  Top 0.61: 124.9,55.85 121.25,59.5 121.25,62 120.25,63 116.85,63 JP5.4 | R34.2 v127,9
  Bottom 0.813: JP5.4 109.04,63.04 106.5,60.5 106.5,46 106,45.5 106,42 106.5,41.5 106.5,5.5 108.5,3.5 125,3.5 127,5.5 v127,9
24V_PWM_LED_UC  (1 unrouted)
24V_PWM_UC  (1 unrouted)
220V_PWM_LED_UC  (1 unrouted)
220V_PWM_UC  (1 unrouted)
+3V3  (via drill 0.6)  (1 unrouted)
  Top 0.813: v119.5,38 119.5,36
  Top 1.016: R31.2 129.52,36.98 130,36.5 130,28 129.94,27.94 C4.1 | C6.1 129.96,27.76 C4.1 | C4.1 126.62,27.74 IC1.4
  Bottom 0.813: JP5.1 119.58,55.42 121,54 121,39.5 v119.5,38
  pour Top (no thermals): 130.5,30 121,30 121,39 118,39 118,35 117,34 106,34 105,33 105,24 128.5,24 130.5,26
+3V3_220V  (1 unrouted)
  Top 1.27: R9.2 82,83.18 82,83 86.96,83
+3V3_ST_LIPIT
  Top 0.406: C13.1 155.5,94.5 156.5,94.5 157.5,93.5 157.5,90.5 156.82,89.83 U5.7 154.99,89.8 153.5,89.8 153,89.3 153,85.5 151.5,84 142.79,84 R14.2 129,83.88 | C10.1 132.46,94.5 134,94.5 135,93.5 135,90 134.44,89.44 U3.7 130.44,89.44 130,89 130,84.88 129,83.88 | 129,83.88 121.32,83.88 120,84 | 120,84 120.1,83.9 121.3,83.9 | JP3.1 119.55,84.09 R29.2 120,84.07 120,84
+3V3_UC  (1 unrouted)
+3V3_UC_LOCAL  (9 unrouted)
  Top 0.305: 56,60.4 56.2,60.2 | JP10.3 65.52,43.36 R18.2
  Top 0.813: C1.1 56.18,59.18 56.2,60.2 58.9,60.2 | 58.9,60.2 60.7,60.2 | 60.7,60.2 64.2,60.2 | 58.9,60.2 58.8,59.79 | 61.03,60.07 60.7,60.2
+12V
  Top 1.016: IC1.3 123.44,34.02 123.44,41.06 123,41.5 | R4.1 116,38.93 116,41 | 116,41 116.5,41.5 123,41.5 | 123,41.5 123.5,41.5 123.5,44 | 124,44 123.5,44 | C5.+ 123.5,44.04 123.5,44 | 116,41 116,41.5 115,42.5 115,46 114.99,47.11 D8.C
+15V
  pour Top (no thermals): 140,25 147.5,25 149.5,24 149.5,10.5 158,10.5 158,32 135.5,32 135.5,26.5 139,26.5
  pour Bottom (no thermals): 150,62.5 150,10.5 160,10.5 160,62.5
BUTTON1_UC  (1 unrouted)
  Top 0.305: U1.18 69.55,37.05 71.75,39.25 82.5,39.25 85.5,42.25 85.5,44.21
BUTTON2_UC  (1 unrouted)
  Top 0.305: U1.12 70.2,27.05 72,25.25 75,25.25 75.5,24.75
BUTTON3_UC  (1 unrouted)
  Top 0.305: 60.77,24.27 61.5,25 64.25,25 65.65,26.4 U1.5
  Top 0.406: 60.77,23 60.77,24.27
CLOCK_DISPLAY
  Top 0.305: U1.15 71.5,35.5 72.25,36.25 88.75,36.25 93.25,40.75 93.25,44.16
DATA_DISPLAY_UC  (1 unrouted)
ENCODER1_1_UC  (1 unrouted)
  Top 0.305: U1.16 70.85,35.85 72.25,37.25 86.75,37.25 90.75,41.25 90.75,44.12
ENCODER1_2_UC  (1 unrouted)
  Top 0.305: U1.17 70.2,36.45 72,38.25 84.25,38.25 88,42 88,44.17
ENCODER2_1_UC  (1 unrouted)
ENCODER2_2_UC  (1 unrouted)
  Top 0.305: U1.11 69.55,26.7 73,23.25 73,22.79
ENCODER3_1_UC  (1 unrouted)
  Top 0.305: U1.27 63.7,36.55 62.75,37.5 56.5,37.5 53,41 53,45.37
ENCODER3_2_UC  (1 unrouted)
  Top 0.305: U1.26 64.35,37.15 63,38.5 58,38.5 55.75,40.75 55.75,45.42
FET_PWM1_ST_LIPIT  (via drill 1)
  Top 0.61: U$9.1 133.15,75.85 132.2,75.9 131.6,75.9 v131.5,76
  Bottom 0.61: v131.5,76 117.58,76 JP3.3
FET_PWM1_UC  (1 unrouted)
  Top 0.305: U1.13 70.85,27.4 72,26.25 77.5,26.25 78,25.75 78,22.79
FET_PWM2_ST_LIPIT  (via drill 1)
  Top 0.61: U$10.1 131.55,63.45 v131.5,63.5
  Bottom 0.61: v131.5,63.5 130,63.5 128,65.5 128,71 125,74 117,74 116.81,74.19 JP3.4
FET_PWM2_UC  (1 unrouted)
  Top 0.305: U1.14 71.5,28.25 72,27.25 80,27.25 80.5,26.75 80.5,22.75
FET_PWM_LED_UC  (1 unrouted)
GND  (via drill 0.6)  (6 unrouted)
  Top 0.305: 133,27.48 C4.2
  Top 0.406: v138.5,10.5 C2.2 | CLH1.GND 137.07,11.93
  Top 0.61: U$8.2 108.65,52.35 109.5,51.5 v109.5,50.5 | 137.07,11.93 137.12,11.93 137.11,10.49 v138.5,10.5 137.1,10.5 | R6.2 137.34,8.74 137.1,9.49 137.1,10.5 | 137.1,12.85 137.1,10.5
  Top 1.016: C5.- 118.58,46.08 119.5,47 127,47 129.5,44.5 129.5,42.4 R22.1 129.43,42.07 130.5,41 130.5,39.67 C11.2 130.91,39.59 133.5,37 | 133.5,37 132.76,36.26 C6.2 132.76,27.76 C4.2 | 133.5,37 134.46,37 137.34,39.88 OUT8.P$2 OUT8.P$1 | OUT4.P$2 OUT4.P$1 | v133,26 133,27.48 | C2.2 R23.1
  Bottom 0.813: JP5.2 111.96,57.96 109.5,55.5 v109.5,50.5
  Bottom 1.016: v138.5,10.5 138,10.7 138,23.5 136,25.5 133.5,25.5 v133,26 132.5,26.5 132.5,32 131.5,33 118,33 116.5,34.5 116.5,45 114.5,47 111,47 109.5,48 v109.5,50.5
  pour Top (no thermals): 135,53 135,37.5 157.5,37.5 157.5,53
GND_220V  (1 unrouted)
  Top 0.305: 74.89,75.5 76.75,75.5
  Top 0.61: 72.12,78.27 72.27,78.27
  Top 0.813: 87.02,75.17 87.17,75.52
  Top 1.27: 74.09,76.3 70.98,73.19 54.34,73.19 50.53,77 U$1.P$3 | OK2.2 72.12,78.27 74.09,76.3 | 87.17,75.52 85.75,75.5 74.89,75.5 74.09,76.3
GND_ST_LIPIT  (via drill 0.6)
  Top 0.406: 152.5,91.1 152,90.6 152,88 151.28,87.28 U5.4 146.31,87.28 C9.2 146.2,87.87 v145.5,88.5 | 152.5,91.1 U5.8 156.09,91.09 156.5,91.5 156.5,92.5 156,93 155.35,93 C13.2 | R13.1 152.57,91.17 152.5,91.1 | 128.4,86.89 U3.4 123.8,86.9 123.22,86.32 C3.2 123.5,86.28 123.5,88 123,88.5 121.5,88.5 v121,89 | 128.4,86.89 129,87.5 129,90 129.7,90.7 | 129.7,90.7 U3.8 133.71,90.7 134,91 134,92 133.5,92.5 132.48,92.5 C10.2 | R28.1 129.67,90.73 129.7,90.7 | D6.C 121.62,95.95 D7.A 121.74,96.26 | D2.C 144.68,95.61 D3.A 144.74,96.29 v147.18,96.3 | 128.4,86.89 127,85.5 v126.5,85.5
  Top 0.61: R3.1 129.62,78.27 129.18,77.83 | U$9.2 129.5,74.05 | 129.5,74.05 129.45,74.05 129,74.5 129,77.65 129.18,77.83 | U$10.2 129.45,61.55 128.9,62 128.9,65.24 129.33,65.67 R10.1 133.78,67 v133.78,66.92 | v129,74 129.5,74.05 | 124.5,96.5 v124,96.5 122,96.5 121.74,96.26 | v128.5,78.5 129.18,77.83
  Bottom 0.406: v147.18,96.3 144.3,96.3 143.5,95.5 143.5,90.5 v145.5,88.5 | 123.5,96.5 v124,96.5 121.5,96.5 121,95.5 v121,89 119.5,87.5 119.5,80.5 118.31,79.31 JP3.2
  Bottom 0.61: v133.78,66.92 131.01,69.28 131,73.5 130.5,74 v129,74 | 123.5,96.5 146,96.5 146.2,96.3 v147.18,96.3 | v126.5,85.5 126,85 126,80 127.5,78.5 v128.5,78.5
GND_TERMOCOUPLE
  Top 0.305: C14.2 20.5,7.85 20.5,11 20,11.5 U6.3 14,11.5 13.5,12 13.5,16 14.5,17 16,17 16.5,17.5 | 16.5,17.5 16.6,17.5 16.8,17.7 JP8.4 16.5,17.5
  pour Top (isolate 0.406, no thermals): 42.5,0 42.5,30 0.25,30 0.25,0.25 0,0
  pour Bottom (isolate 1.016, no thermals): 0,30 42.5,30 42.5,0 0,0
GND_UC  (via drill 0.6)  (4 unrouted)
  Top 0.61: 56.25,52.5 56.5,52.5 56.28,52.72 C1.2
  other vias: 51.25,13
  pour Bottom (isolate 1.016, no thermals): 46.75,62.25 45.75,62.5 45.75,0.25 98.75,0 98.75,62.25
  pour Top (isolate 0.813, no thermals): 98.75,62.25 45.75,62.5 45.75,0.25 98.75,0
LATCH_DISPLAY_UC  (1 unrouted)
  Top 0.305: U1.19 68.9,37.65 71.5,40.25 81.25,40.25 83,42
N$2  (via drill 0.6 pad 1.02)
  Top 0.61: D1.K 122.91,68.41 124.5,70 137,70 138.5,68.5 v138.5,63.5 137.5,62.5 U$10.3 136,62.5 | U2.2 151.84,67 v153.5,67
  Bottom 0.61: v153.5,67 141,67 138.5,64.5 v138.5,63.5
N$3
  Top 0.61: R5.1 129.44,71.87 124.1,71.9 122.71,73.29 D4.A
N$4
  Top 0.61: D1.A 122.81,60.59 124.4,59 133.52,59 R17.1
N$5
  Top 0.406: 105,51.5 U$8.3
  Top 0.813: SP1.- 108.28,44.72 105,48 105,51.5
  Top 1.016: SP1.- 108.28,37.05 D9.A 108.31,37.14
N$6
  Top 0.305: R16.2 140.25,14.5 | 134.88,12.41 CLH1.CS
  Top 0.406: 140.25,14.5 135.39,14.53 134.88,14.03 134.88,12.41
N$7  (via drill 0.6 pad 1.02)
  Top 0.61: D4.K 122.71,80.71 124,82.5 137,82.5 138.8,80.7 v138.8,76.3 137.5,75 U$9.3 | U4.2 153.38,76.18 v153.8,76.3
  Bottom 0.61: v153.8,76.3 v138.8,76.3 138.5,76
N$8  (via drill 0.6 pad 1.02)
  Top 0.61: U2.4 151.8,69 v153.5,69 | v137,65.5 135.5,65.5 135.56,65.56 R10.2 135.74,65.85
  Bottom 0.61: v153.5,69 139.5,69 137,66.5 v137,65.5
N$9
  Top 0.406: U3.6 135.16,88.17 136.5,89.5 136.5,94 134.5,96 129.5,96 129.34,96.16 R27.2 127.16,96.16 126.17,95.17 R26.1
N$10
  Top 0.406: D7.C 121.87,91.25 D6.A 118.26,88.48 R30.1 | 122.05,90.33 D7.C | U3.3 124.83,88.17 123.59,89.46 122.5,89.47 D7.C
N$11
  Top 0.406: 127.95,93.85 R28.2 127.97,93.97 | U3.2 125.06,89.44 124.5,90 124.5,93 125,93.5 125.5,93.5 | 125.5,93.5 127.5,93.5 127.97,93.97 | 127.97,93.97 128,94 | R26.2 125.65,93.35 125.5,93.5
N$12
  Top 1.27: OK2.6 56.88,75.73 55.61,77 R20.1
N$13
  Top 1.27: D5.A 63.07,84.27 OK2.4
N$14
  Top 0.61: 67.04,75.73 OK2.1
  Top 1.27: R21.2 73.56,85.33 72.12,83.35 67.04,83.35 65.77,82.08 65.77,77 67.04,75.73
N$15  (1 unrouted)
N$16
  Top 0.406: CLH1.VCC 142.69,20.19 144.5,22 | U$7.1A 144.7,19.7 144.5,19.5
  pour Top (isolate 0.406, no thermals): 104.5,22 129.5,22 131.1,23.5 145.5,23.5 147.1,22.9 147.1,16 127.5,16 124.5,13 124.5,3.5 123,2.5 106,2.5 104.5,4
N$17_UC  (via drill 1.4)
  Top 1.016: v85,26 v85,22.75
N$18
  Top 1.27: U$6.G 64.76,94.52 D5.C
N$19
  Top 0.406: 113,37 112.93,37 D9.C
  Top 1.016: SP1.+ 112.28,37.72 113,37 | D9.C 115.66,36.89 R4.2
N$20
  Top 0.406: CLH1.FR_DIAG 135.76,9.07
  Top 0.61: 135.76,9.07 135.77,9.44 136.05,9.44 135.5,8.89 135.5,9.25 135.75,9 R6.1
N$21
  Top 0.305: 20.22,79.49 R8.1
  Top 0.61: OUT6.P$1 19.76,70.94 20.05,70.65
  Top 1.27: 20.22,79.49 R2.1 19.31,76.12 OUT6.P$2 19.6,70.65 20.05,70.65 F1.1
  pour Top (no thermals): 1,74.46 1,65.57 27.67,65.57 30.21,68.11 30.21,71.92 27.67,74.46
N$25
  Top 0.305: 101.25,101 101.25,-2.75
N$26
  Top 0.61: 100.75,63.5 100.75,63.75 44.25,63.75 | 44.25,63.75 -2.25,63.75 | 44.25,63.75 44.25,-3
N$27  (via drill 0.6 pad 1.02)
  Top 0.61: U4.4 153.34,78.46 v153.8,78.3 | 135.5,78.78 R3.2 136.73,78.27 v137,78.5
  Bottom 0.61: v137,78.5 153.6,78.5 v153.8,78.3
N$28  (1 unrouted)
N$29
  Top 0.406: U5.6 157.56,88.56 158.5,89.5 158.5,94.5 157,96 152.5,96 R12.2 152.16,95.55 R11.1
N$30
  Top 0.305: 37.08,84.5 U$2.K
  Top 1.27: R33.2 R1.2 31.12,83.98 U$3.A U$2.K 37.2,84.02 41.04,84.02 41.64,83.35 U$1.P$1
N$31
  Top 0.406: R15.1 141.26,89.1 D2.A 141.32,90.97 D3.C 144.74,90.76 145,90 146.03,89.97 147.5,88.5 149.75,88.5 U5.3
N$32
  Top 0.305: 30.41,77.06 R2.2
  Top 1.27: R8.2 30.41,77.06 | U$1.P$2 41.64,78.27 40.81,77.6 37.2,77.6 U$2.A U$3.K 30.99,77.64 R2.2
N$34
  Top 0.406: R13.2 150.83,93.87 148.87,93.87 149,94 149.07,93.93 R11.2 147.85,93.85 147.5,93.5 147.5,90.3 148,89.8 149.78,89.8 U5.2
N$35
  pour Top (isolate 0.305, no thermals): 158,2.5 126.5,2.5 126.5,6.5 128.75,6.5 129.5,7.25 129.5,12.5 130.6,13.3 133.22,13.3 133.22,7.8 134.25,7 138.5,7 140,9 158,9
N$36  (2 unrouted)
  Top 1.27: 82.12,80.5 R9.1
  Bottom 0.813: 87.24,80.59 86.73,80.48
  Bottom 1.27: U$1.P$4 53.07,82.08 54.34,80.81 54.34,77 58.15,73.19 72.79,73.19 80.73,80.63 87.24,80.59
N$37  (1 unrouted)
  Top 0.305: U$12.P$2 63.5,23 63.49,23.49 64,23.5 66.3,25.8 U1.6 66.3,29.95 65.5,30.5 58.25,30.5
N$38
  Top 0.305: 19,12.5 18.99,12.49 U6.1 16.01,12.49 15.5,13 15.5,14 R7.2
N$39  (1 unrouted)
  Top 0.305: U$12.P$1 66.2,24.4 66.95,25.2 U1.7 66.95,30.55 66,31.25 60.75,31.25 60.5,31.5
N$40
  Top 0.305: U$4.P$1 10.23,11.3 C7.1 11,11.8 11,11.25 12.65,9.5 17,9.5 18.01,10.51 U6.5
N$41
  Top 0.305: U$4.P$2 10.01,13.95 C7.2 10.85,13.25 12,13.25 12.5,12.75 12.5,11.5 13.5,10.5 16.5,10.5 16.99,10.99 U6.4
N$42
  Top 1.016: R22.2 127.79,42.27 R31.1 127.78,39.97 C11.1 127.78,33.9 IC1.1
N$43
  Top 0.305: U$5.P$1 30.94,14 C12.1 29.48,13.56 27,11 23.19,11 U6.7
N$44
  Top 0.305: U$5.P$2 31.05,11.35 C12.2 31.1,11.5 29.5,11.5 28,10 25,10 24.49,10.51 U6.6
N$46
  Top 0.406: CLH1.INPUT 134.01,13.99 133.5,14.5 128.5,14.5 127,13 R34.1
N$50
  Top 0.61: R17.2 135.5,59.07 136.1,59 140.73,59 U$11.1B | R5.2 135.86,71.5 140.5,71.5 144,68 144.5,68
  pour Top (no thermals): 147.5,56.5 141.5,56.5 140.5,57.5 140.5,81 147.5,81
N$51  (via drill 0.6)
  Top 1.016: D8.A 122.39,50.61 v124.91,50.62
  Bottom 1.016: v124.91,50.62 126.36,50.63 131,45.5 131,40.27 JP12.2
N$52
  Top 0.305: U$14.2A U$14.1A 5.26,8 2,8 1.5,8.5 1.49,13.46 1.99,13.96 U$4.P$3
N$53
  Top 0.305: U$4.P$4 3.66,10.5 4.16,10 10.5,10 12,8.5 12.36,8.5 U$14.1B
  Top 0.406: U$14.2B U$14.1B
N$54
  Top 0.305: U$15.1B 37.78,6.78 40.5,9 40.5,13.5 40,14 38.65,14 U$5.P$4
  Top 0.406: U$15.2B U$15.1B
N$55
  Top 0.305: U$5.P$3 38.46,10.61 37.86,10.01 32,10 30.5,8 28.7,8 U$15.1A
  Top 0.406: U$15.1A U$15.2A
NULL1
  pour Bottom (isolate 1.27, no thermals): 0.25,100 99.5,100 99.5,65 0.25,65
NULL2
  pour Bottom (isolate 1.016, no thermals): 160,0 160,100 103,99.75 103,0
RST
  Top 0.305: U1.24 65.65,38.35 62.5,41.5 62.5,42.75 | 62.5,42.75 62.5,45 62.98,45.48 63,45.48 JP10.2 | R18.1 62.58,42.67 62.5,42.75
RX
  Top 0.305: U1.3 64.35,27.1 63.75,26.5 57.25,26.5 55.75,25 55.75,23.19
  Top 0.406: 55.75,23 55.75,23.19
SCL  (5 unrouted)
  Top 0.305: U1.22 66.95,40.2 70,43.25 75,43.25 75.5,43.75 75.5,45.5
SCL_TERMOCOUPLE
  Top 0.305: U6.10 23.99,12.49 24.5,13 24.5,13.5 24,14 21,14 19.5,15.5 19.5,17.5 19.31,17.69 JP8.3
SDA  (5 unrouted)
  Top 0.305: U1.23 66.3,40.8 69.75,44.25 71.59,44.25
SDA_TERMOCOUPLE
  Top 0.305: U6.9 25.01,12.01 25.5,12.5 25.5,14.5 25,15 22.5,15 22,15.5 22,17.46 JP8.2
SPEAKER  (1 unrouted)
  Top 0.813: U$8.1 107.3,48.7 108,48 111.5,48 113,49.5
SPEAKER_UC
  Top 0.305: U1.20 68.25,38.5 71,41.25 79.25,41.25 80.5,42.5 80.5,44.21
TEST
  Top 0.305: U1.25 65,37.75 63.25,39.5 61.25,39.5 60.5,40.25 60.5,45.44 JP10.1
TIP+_1  (via drill 0.6, 0.6 pad 5)
  Top 0.406: R15.2 142.5,86.79 | 142.5,86.79 144.48,86.79 C9.1 138.72,86.72 v138.5,86.5 | R14.1 142.67,86.77 142.7,86.8 142.51,86.8 142.5,86.79
  Bottom 0.406: v138.5,86.5 138.5,84.5 140,83 155.5,83 157,82 157,78 v157.6,77.4
  pour Top (no thermals): 155,79.3 150,79.3 150,80.5 150.5,81 160.5,81 160.5,73.5 150.5,73.5 150,74 150,75.1 150.2,75.3 155,75.3
TIP+_2  (via drill 0.6, 0.6 pad 5)
  Top 0.406: 118.36,86.82 C3.1 122,86.58 v122,85 | 118.36,86.82 118.2,86.82 119.98,86.84 R29.1 | 118.36,86.82 R30.2 | U2.5 155.24,70.26 v157.5,68
  Bottom 0.406: v122,85 123.5,85 125.5,87 130.5,87 132,88.5 140.5,88.5 144,85 157,85 159,83 159,69.5 v157.5,68
  pour Top (no thermals): 155,70 150,70 150,71.2 150.5,71.7 160.2,71.7 160.2,64.2 150.5,64.2 150,64.7 150,65.8 150.2,66 155,66
TIP_TEMP1_ST_LIPIT
  Top 0.61: JP3.6 113.85,69.15 111.5,71.5 111.5,96.5 115.5,99.5 151,99.5 152.5,98 152.5,97.63 | 152.5,97.5 152.5,97.63 | 152.5,97.63 R12.1
TIP_TEMP1_UC
  Top 0.406: 63.48,15.23 63.48,17.47 63.49,18.15 U$12.P$3
TIP_TEMP2_ST_LIPIT
  Top 0.61: JP3.5 114.81,71.69 113.5,73 113.5,95.5 116.5,98 129.03,98 | 129.5,98 129.03,98 | 129.03,98 R27.1
TIP_TEMP2_UC
  Top 0.406: 65.77,15.77 66.2,15.76 U$12.P$4
TX
  Top 0.305: U1.4 65,26.75 64,25.75 59,25.75 58.25,25 58.25,23.02
  Top 0.406: 58.25,23 58.25,23.02
VCC_TERMOCOUPLE
  Top 0.305: 22,11.5 U6.8 26,11.5 26.5,12 26.5,15 25.5,16 24.5,16 24.5,17.5 JP8.1 | 22,11.5 21.5,11 21.5,8 22,7.5 C14.1 | R7.1 19.5,14 22,11.5
~+OUT
  Top 1.27: F1.2 85.58,70.65 OUT2.P$1
  pour Top (no thermals): 52.31,70.65 47.99,74.46 40.37,74.46 39.1,73.19 39.1,68.11 40.37,66.84 93.71,66.84 93.71,73.19 75.93,73.19 73.39,70.65
~-OUT
  Top 1.27: 87.41,89.92 OUT1.P$1
  Top 4.826: U$6.T1 87.41,89.92
  pour Top (no thermals): 70.5,87.5 70.5,95.5 74.5,99.5 94.5,99.5 94.5,87.5
~IN1
  Top 0.61: 55.61,90.78 U$6.T2
  Top 1.27: R1.1 R33.1 20.25,86.94 OUT5.P$2 | R20.2 55.61,90.78
  pour Top (no thermals): 58.15,87.16 1,87.16 1,98.59 58.15,98.59
(copper drawn outside any net)
  shapes: Bottom area x1, Top area x1

### Text on the board
Top: ENCODER3_1 | ENCODER3_2 | TEST | RESET | +3V3 | GND | ENCODER3_3 | 24V_PWM | DATA_DISPLAY | SPEAKER_UC | ZERO_CROSS_220V | LATCH_DISPLAY | ENCODER1_3 | ENCODER1_2 | ENCODER1_1 | CLOCK_DISPLAY | +3V3 | SDA | LED | PANEL 24V | FRONT | CLCK | GND | TIP_TEMP2 | TIP_TEMP1 | PWM_220V_LED | I2C | 3V3 | GND | SCL | SDA | 3V3 | 24V_CS_UC | RX | TX | 220V_PWM | ENCODER2_1 | ENCODER2_2 | ENCODER2_3 | FET_PWM1 | FET_PWM2